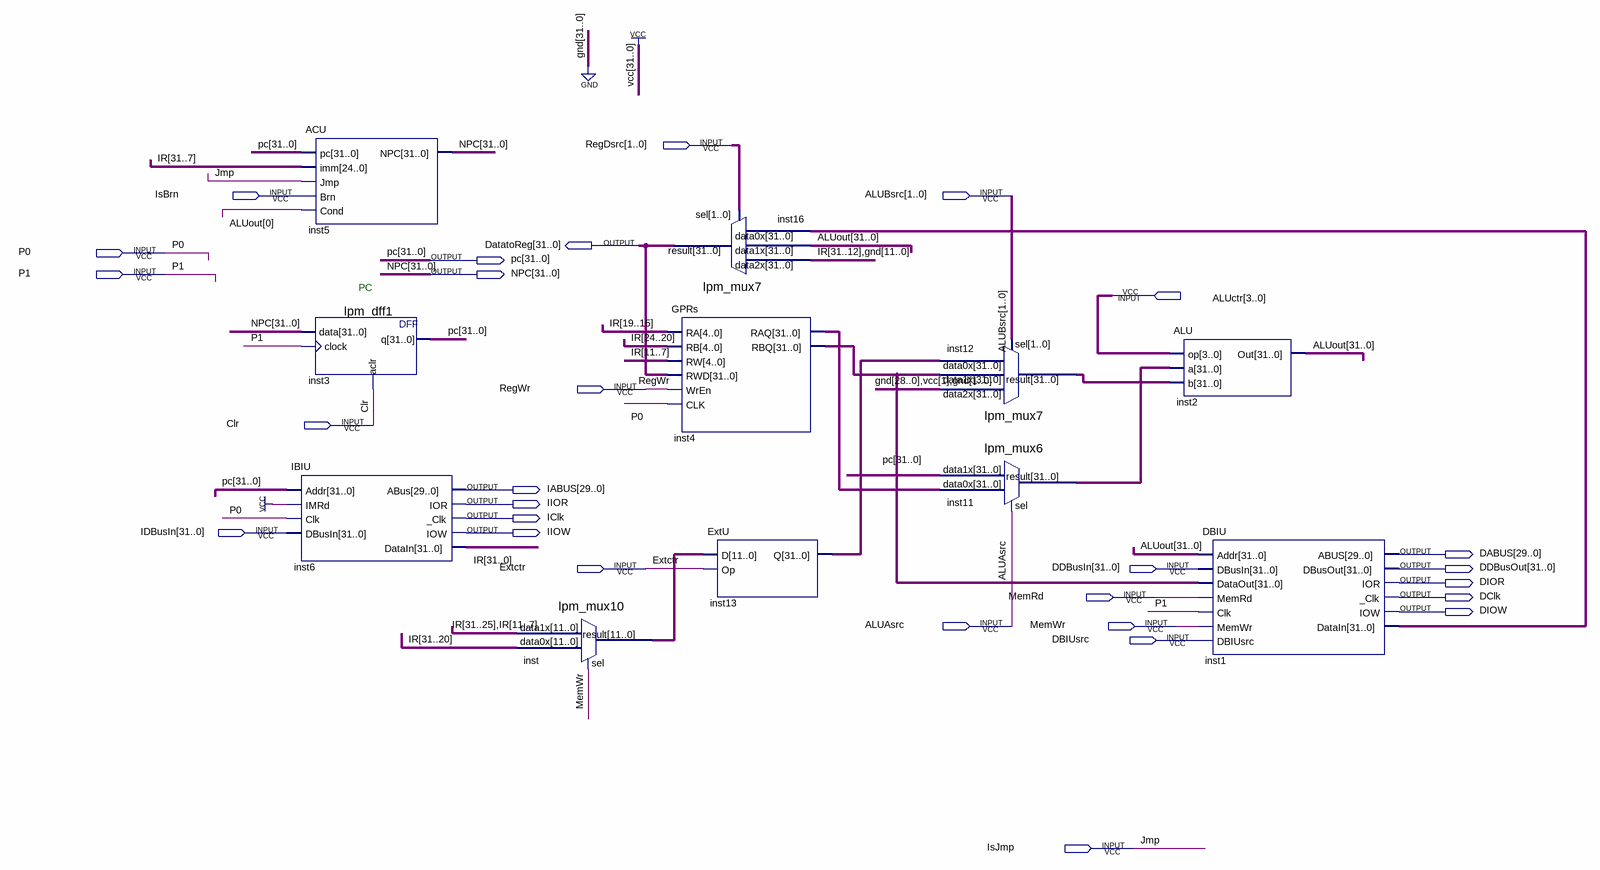
[diagram p0: schematic sheet]
// Quartus schematic DataPath.bdf as structural Verilog: 11 symbols, 28 pins
module DataPath (
  input  [1:0] RegDsrc,
  input  IsBrn,
  input  [1:0] ALUBsrc,
  input  P0,
  input  P1,
  input  [3:0] ALUctr,
  input  RegWr,
  input  Clr,
  input  [31:0] IDBusIn,
  input  Extctr,
  input  [31:0] DDBusIn,
  input  MemRd,
  input  ALUAsrc,
  input  MemWr,
  input  DBIUsrc,
  input  IsJmp,
  output [31:0] DatatoReg,
  output [31:0] pc,
  output [31:0] NPC,
  output [29:0] IABUS,
  output IIOR,
  output IClk,
  output IIOW,
  output [29:0] DABUS,
  output [31:0] DDBusOut,
  output DIOR,
  output DClk,
  output DIOW
);

  wire [11:0] inst_result;
  wire [31:0] ALUout, inst1_datain, inst4_raq, inst4_rbq, inst11_result, inst12_result, inst13_q, IR;

  ACU inst5 (.pc(pc), .imm(IR[31:7]), .Jmp(IsJmp), .Brn(IsBrn), .Cond(ALUout[0]), .NPC(NPC));
  lpm_dff1 inst3 (.data(NPC), .clock(P1), .aclr(Clr), .q(pc));
  IBIU inst6 (
    .Addr(pc), .IMRd(1'b1), .Clk(P0), .DBusIn(IDBusIn), .ABus(IABUS), .IOR(IIOR), ._Clk(IClk), .IOW(IIOW),
    .DataIn(IR));
  lpm_mux10 inst (.data1x({IR[31:25], IR[11:7]}), .data0x(IR[31:20]), .sel(MemWr), .result(inst_result));
  lpm_mux7 inst16 (
    .data2x({IR[31:12], {12{1'b0}}}), .data1x(ALUout), .data0x(inst1_datain), .sel(RegDsrc),
    .result(DatatoReg));
  GPRs inst4 (
    .RA(IR[19:15]), .RB(IR[24:20]), .RW(IR[11:7]), .RWD(DatatoReg), .WrEn(RegWr), .CLK(P0), .RAQ(inst4_raq),
    .RBQ(inst4_rbq));
  ExtU inst13 (.D(inst_result), .Op(Extctr), .Q(inst13_q));
  lpm_mux7 inst12 (
    .data2x(32'b00000000000000000000000000000100), .data1x(inst4_rbq), .data0x(inst13_q), .sel(ALUBsrc),
    .result(inst12_result));
  lpm_mux6 inst11 (.data1x(pc), .data0x(inst4_raq), .sel(ALUAsrc), .result(inst11_result));
  ALU inst2 (.op(ALUctr), .a(inst11_result), .b(inst12_result), .Out(ALUout));
  DBIU inst1 (
    .Addr(ALUout), .DBusIn(DDBusIn), .DataOut(inst4_rbq), .MemRd(MemRd), .Clk(P1), .MemWr(MemWr),
    .DBIUsrc(DBIUsrc), .ABUS(DABUS), .DBusOut(DDBusOut), .IOR(DIOR), ._Clk(DClk), .IOW(DIOW),
    .DataIn(inst1_datain));

  // Other names for the same wires on the sheet: Jmp = IsJmp

  // Notes on the sheet:
  //   PC
endmodule
